# EAGLE design hs-256-expansion (EAGLE 8.3.2)
DESIGNER: Jonathan P. Newman; DESIGN_NAME: headstage-256 Expansion Boards; LICENSE: CERN OHL v1.2; REVISION: 1.0
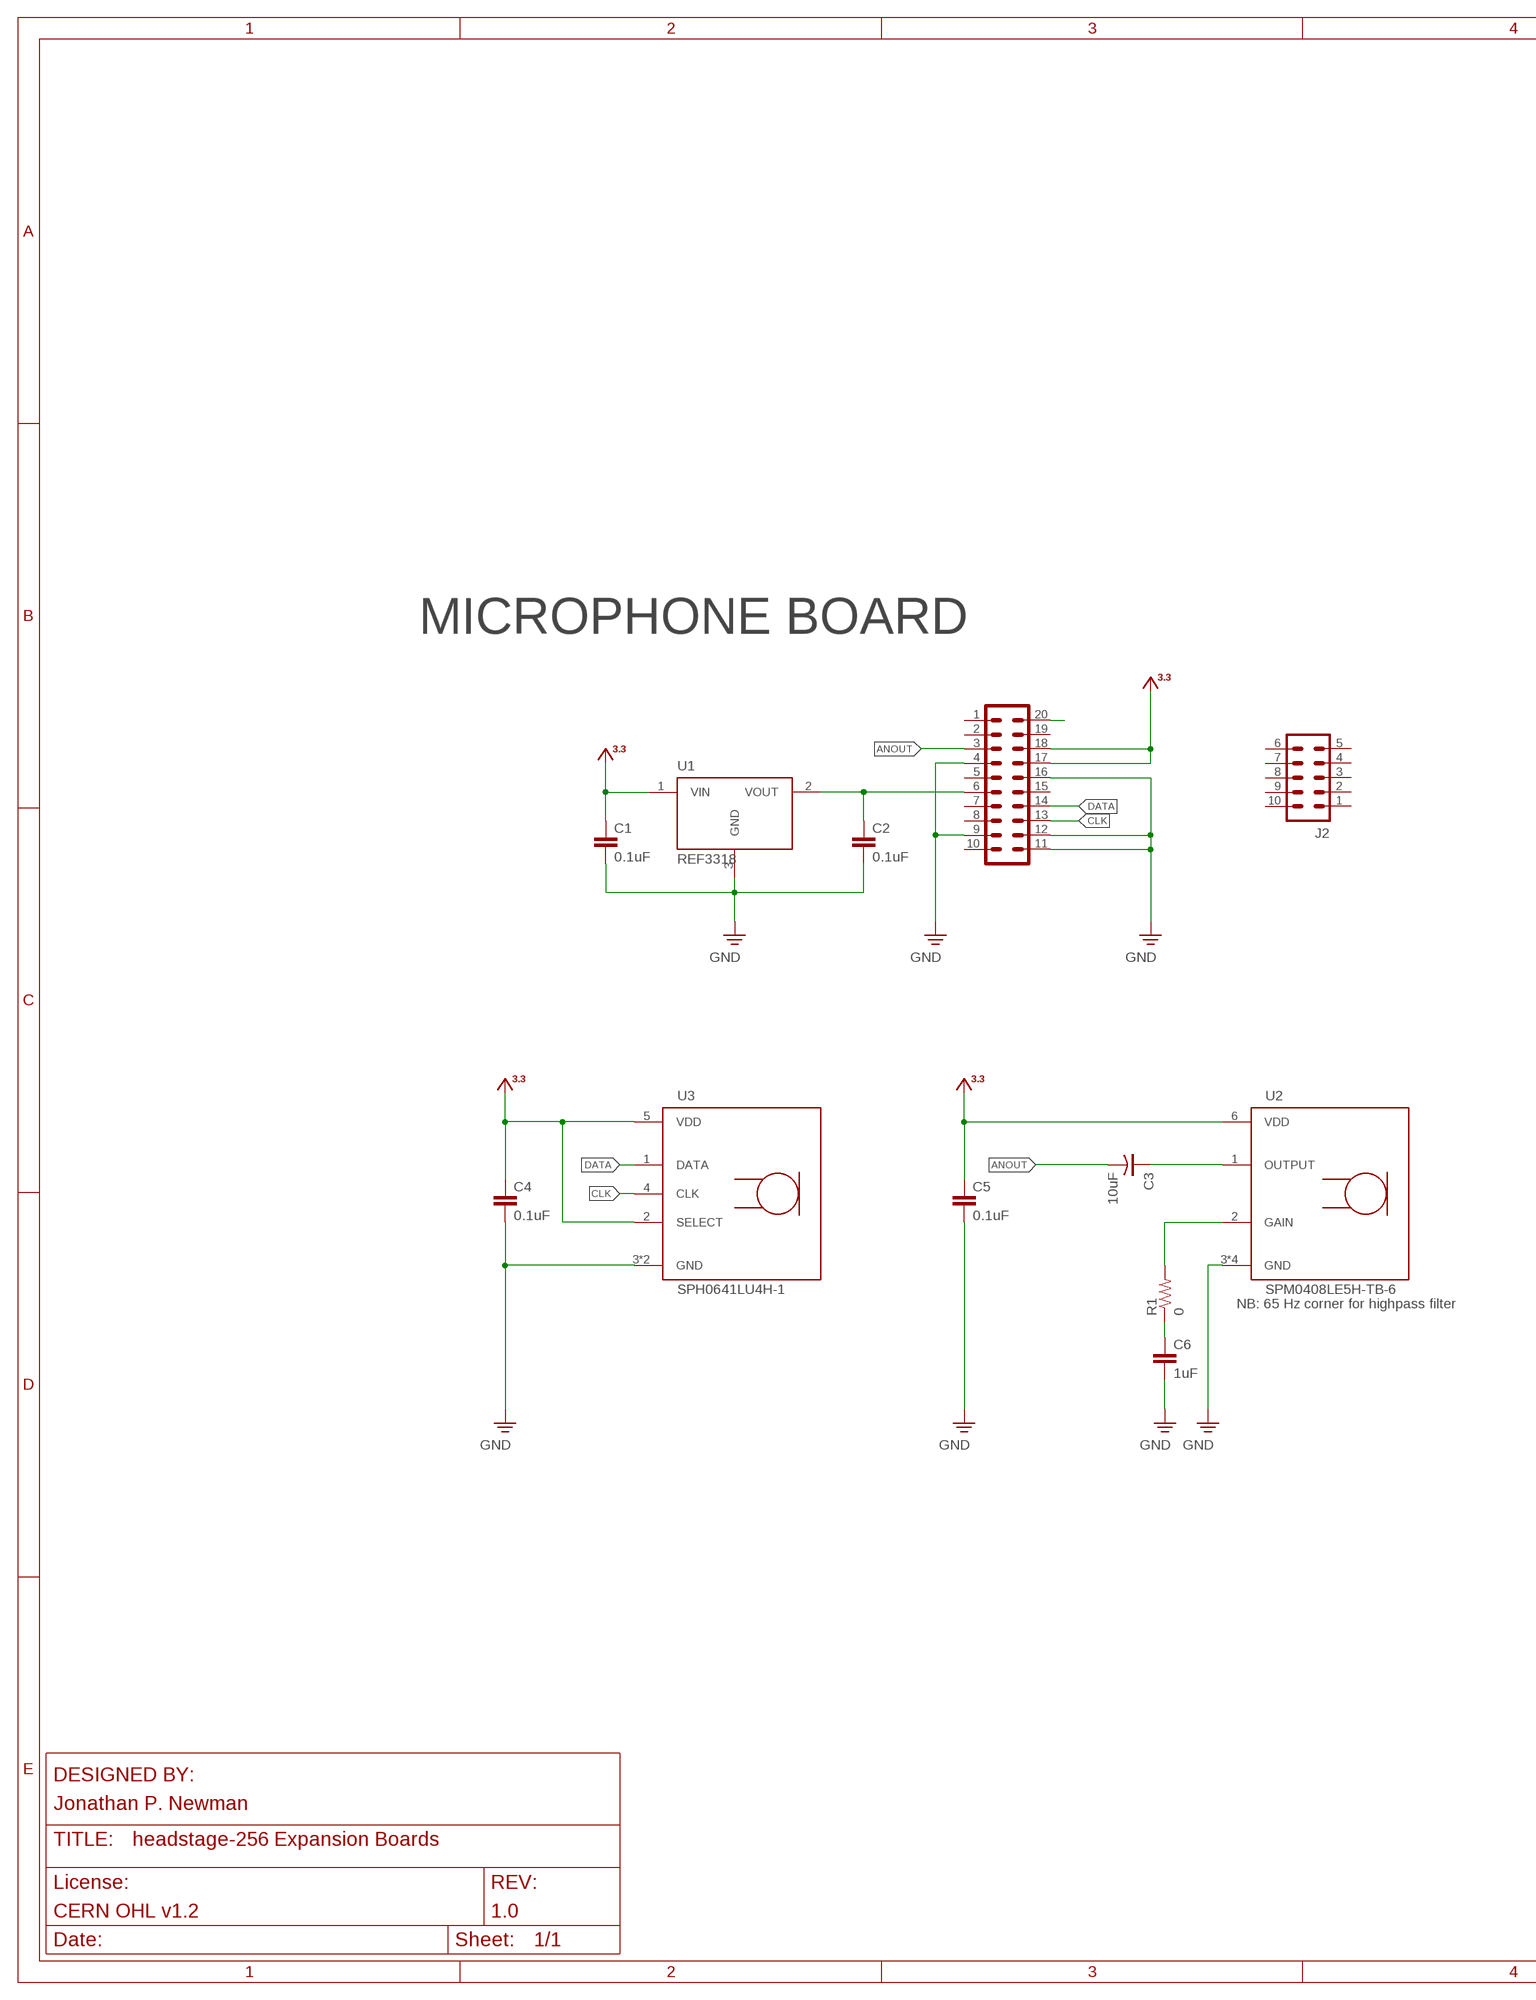
[diagram p0: schematic, sheet 1, part 1 of 2]
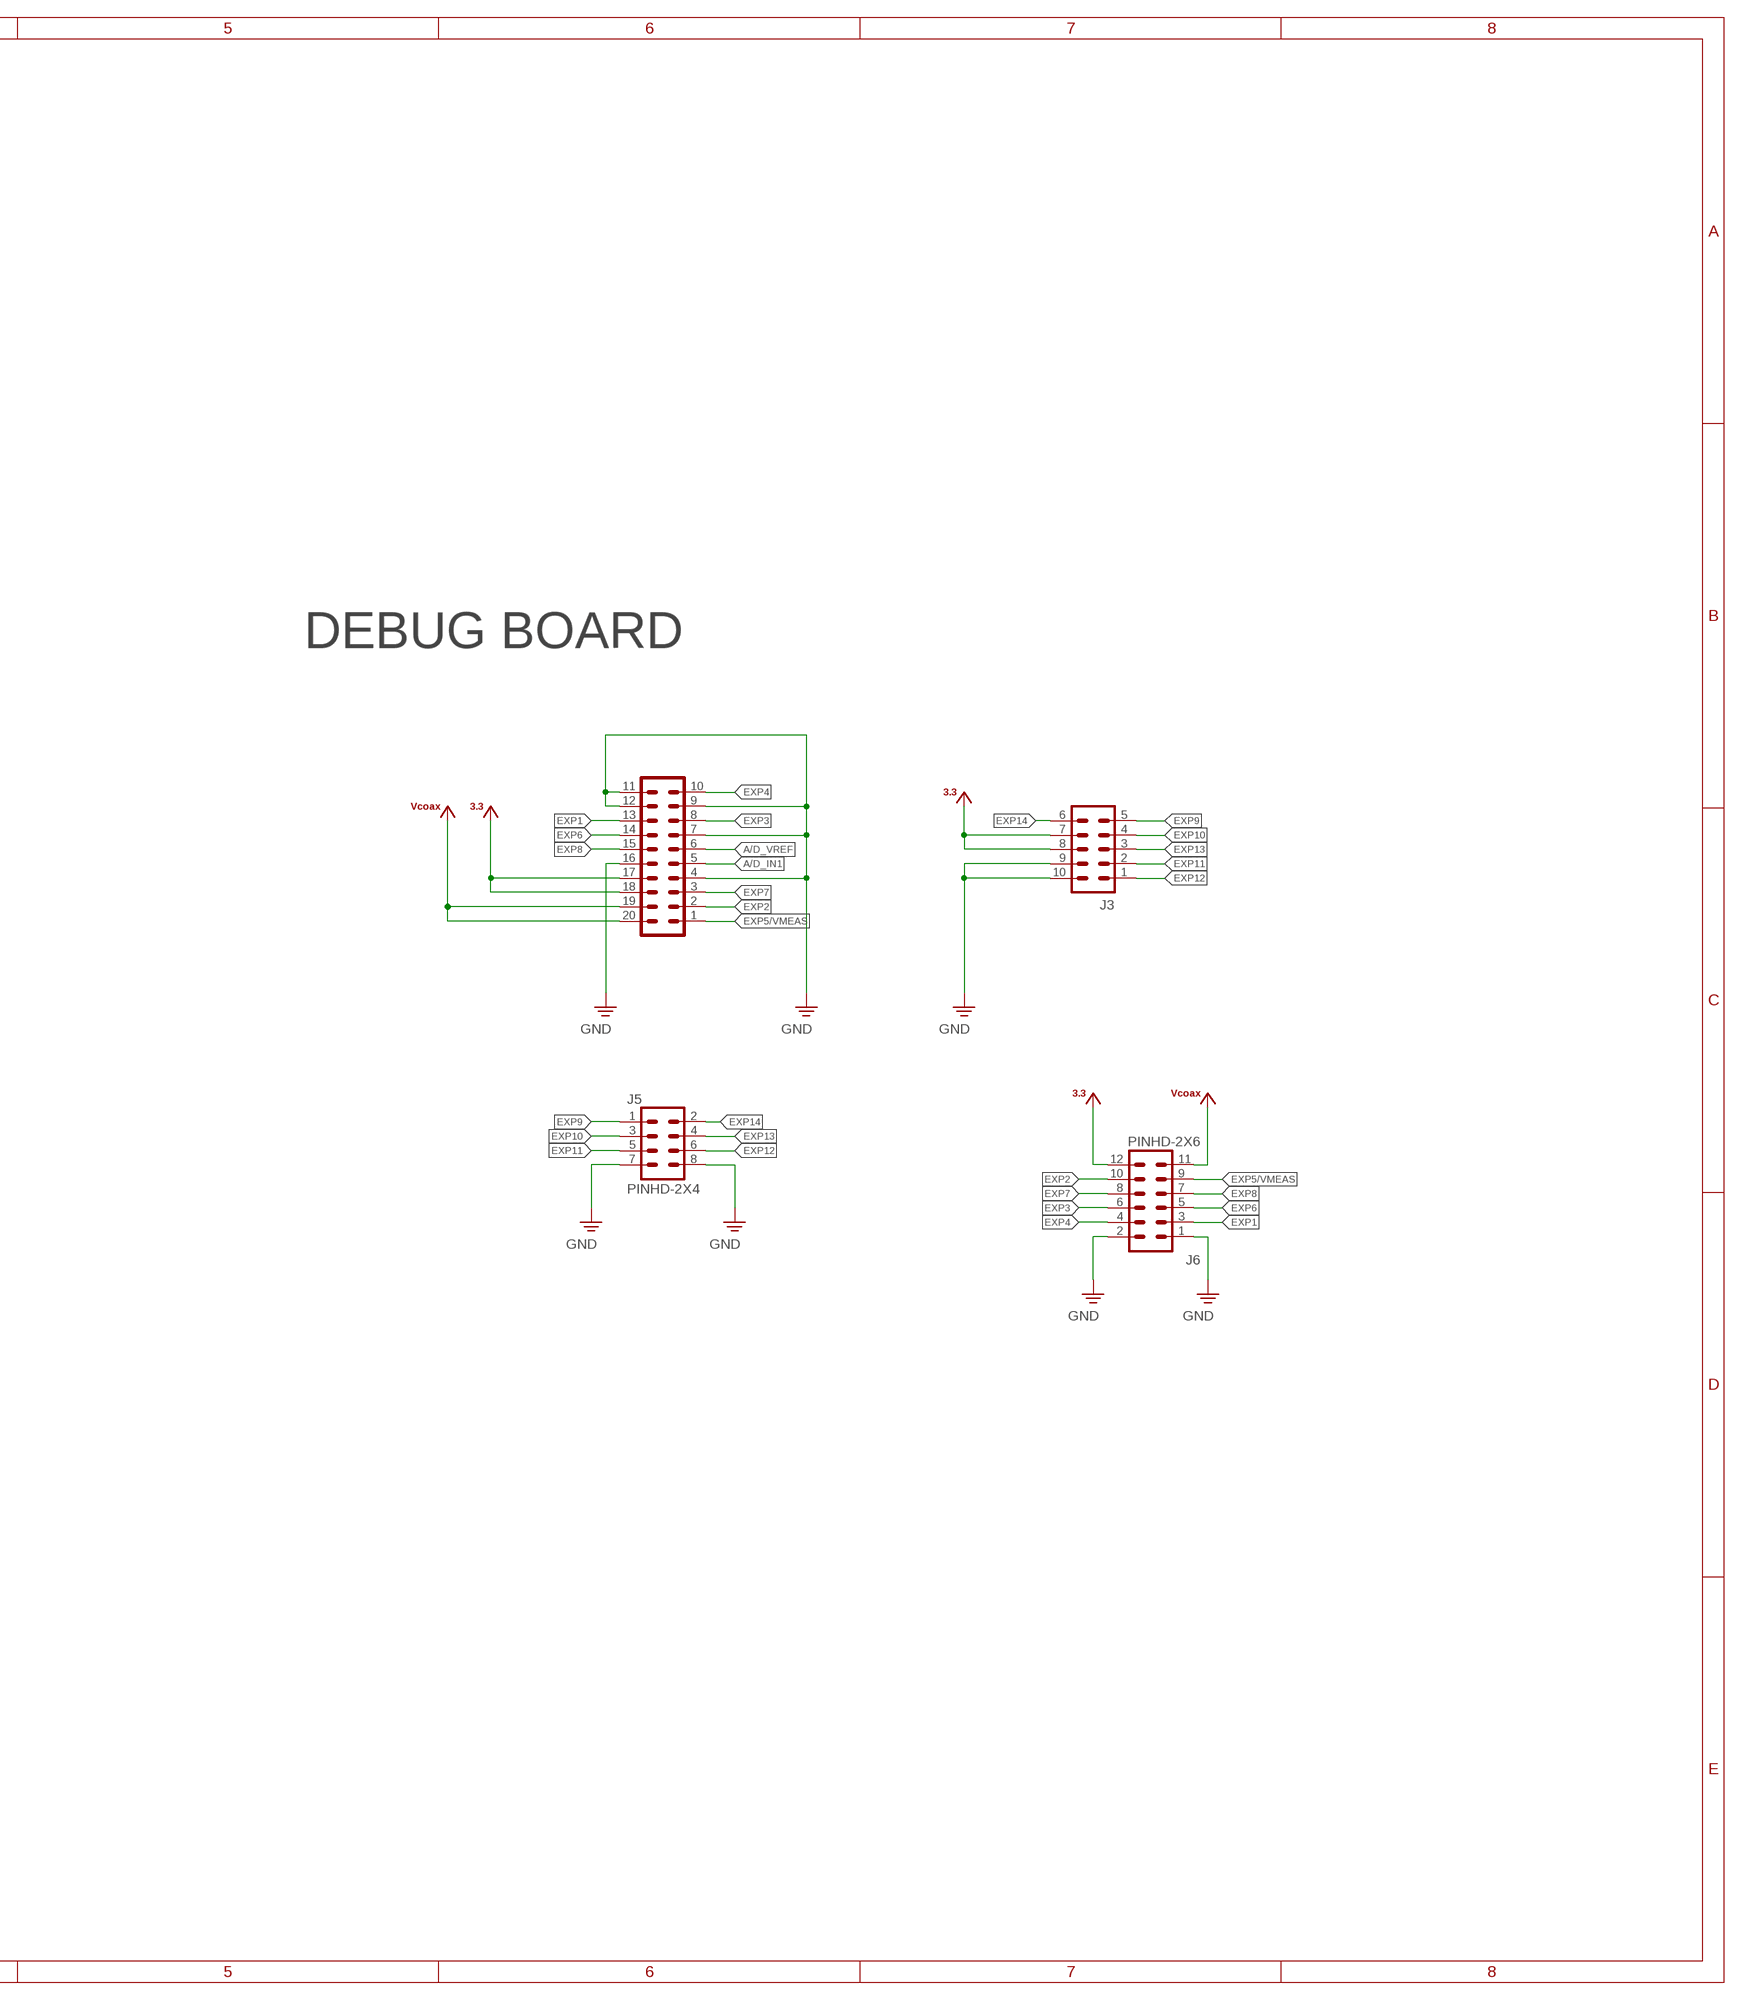
[diagram p1: schematic, sheet 1, part 2 of 2]

## Parts
C1  0.1uF  C_0402  [0402]
C2  0.1uF  C_0402  [0402]
C3  10uF  C-POL_0805  [0805-POL]
C4  0.1uF  C_0402  [0402]
C5  0.1uF  C_0402  [0402]
C6  1uF  C_0402  [0402]
J1  PINHD-2X10_DF40-20REC  [DF40-20REC]
J2  PINHD-2X5_DF40-REC  [DF40-10REC]
J3  PINHD-2X5_DF40-REC  [DF40-10REC]
J4  PINHD-2X10_DF40-20REC  [DF40-20REC]
J5  PINHD-2X4  [2X04-BIG]
J6  PINHD-2X6  [2X06-BIG]
R1  0  R_0402  [0402]
U1  REF3318  VREF_SOT  [SOT23]
U2  SPM0408LE5H-TB-6  MICROPHONE-AN_SPM  [KNOWLES-SPM]
U3  SPH0641LU4H-1  MICROPHONE-PCM_SPH  [KNOWLES-SPH]

## Nets
+3V3: C1.1 C4.1 C5.1 J1.17 J1.18 J3.7 J3.8 J4.17 J4.18 J6.12 U1.1(VIN) U2.6(VDD) U3.2(SELECT) U3.5(VDD)
A/D_IN1: J4.5
A/D_VREF: J4.6
ANOUT: C3.C(-) J1.3
CLK: J1.13 U3.4(CLK)
DATA: J1.14 U3.1(DATA)
EXP1: J4.13 J6.3
EXP2: J4.2 J6.10
EXP3: J4.8 J6.6
EXP4: J4.10 J6.4
EXP5/VMEAS: J4.1 J6.9
EXP6: J4.14 J6.5
EXP7: J4.3 J6.8
EXP8: J4.15 J6.7
EXP9: J3.5 J5.1
EXP10: J3.4 J5.3
EXP11: J3.2 J5.5
EXP12: J3.1 J5.6
EXP13: J3.3 J5.4
EXP14: J3.6 J5.2
GND: C1.2 C2.2 C4.2 C5.2 C6.2 J1.4 J1.9 J1.11 J1.12 J1.16 J3.9 J3.10 J4.4 J4.7 J4.9 J4.11 J4.12 J4.16 J5.7 J5.8 J6.1 J6.2 U1.3(GND) U2.3(GND) U2.4(GND) U2.5(GND) U2.7(GND) U3.3(GND) U3.6(GND)
N$1: C6.1 R1.1
N$2: J1.20
N$3: R1.2 U2.2(GAIN)
N$5: C3.A(+) U2.1(OUTPUT)
VCOAX: J4.19 J4.20 J6.11 ; supply symbol labelled +VCOAX
VREF: C2.1 J1.6 U1.2(VOUT)
Unconnected: J1.1 J1.2 J1.5 J1.7 J1.8 J1.10 J1.15 J1.19 J2.1 J2.2 J2.3 J2.4 J2.5 J2.6 J2.7 J2.8 J2.9 J2.10

## Notes on the sheet
- MICROPHONE BOARD | DEBUG BOARD
- NB: 65 Hz corner for highpass filter

## Library data of the parts
C1 C2 C4-C6 = jonnew:C: Capacitor
C3 = jonnew:C-POL: Polarized Capacitor
J1 J4 = jonnew:PINHD-2X10
J2 J3 = jonnew:PINHD-2X5
J5 = jonnew:PINHD-2X4
J6 = jonnew:PINHD-2X6
R1 = jonnew:R: Resistor
U1 = jonnew:VREF
U2 = jonnew:MICROPHONE-AN
U3 = jonnew:MICROPHONE-PCM

## Board
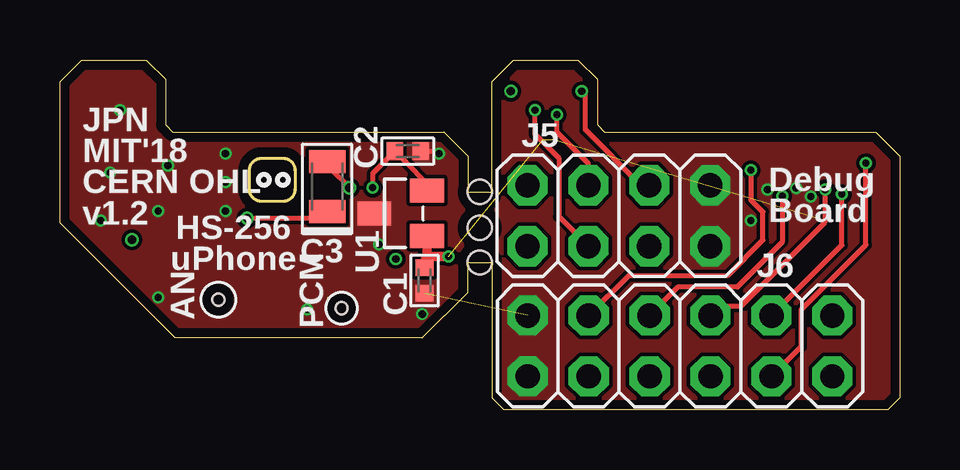
[diagram p2: board, top side]
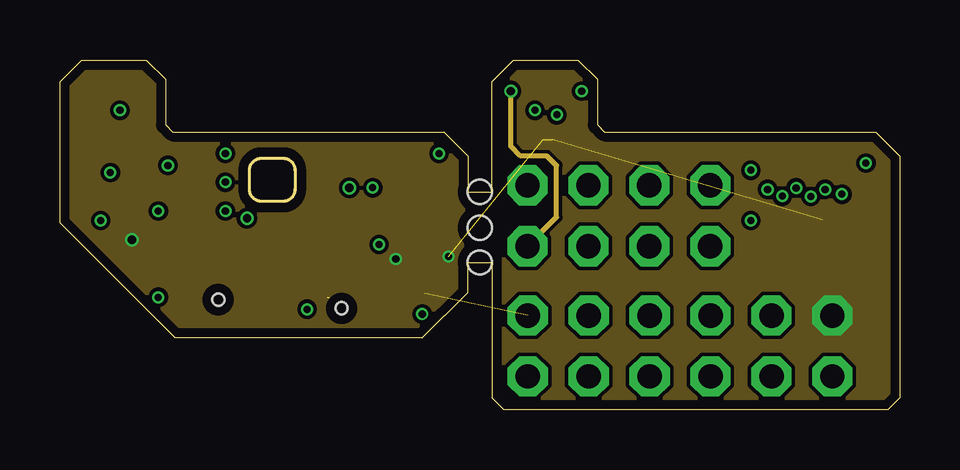
[diagram p3: board, inner layer Route2]
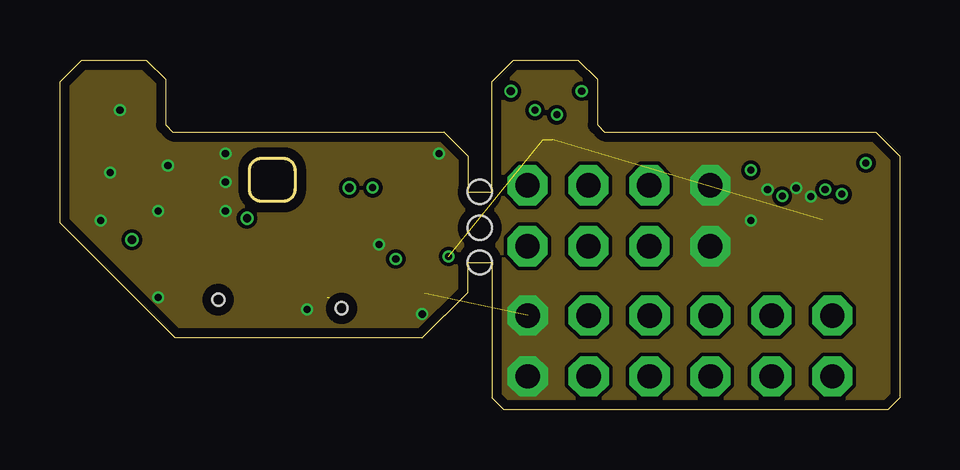
[diagram p4: board, inner layer Route15]
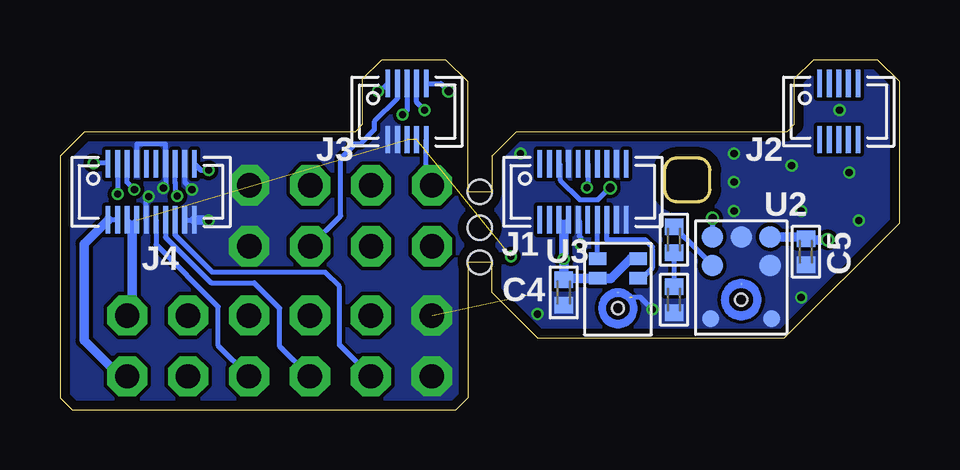
[diagram p5: board, bottom side, seen from below]

Size 35 x 14.6 mm. Coordinates in mm from the lower left corner, seen from the top.
Outline: 0,7.8 0,13.7 0.9,14.6 3.6,14.6 4.4,13.8 4.4,11.9 4.7,11.6 16,11.6 17,10.6 17,9.1 18,9.1 18,13.7 18.9,14.6 21.6,14.6 22.4,13.8 22.4,11.9 22.7,11.6 34,11.6 35,10.6 35,0.5 34.5,0 18.5,0 18,0.5 18,6.15 17,6.15 17,4.9 15.1,3 4.8,3 0,7.8
Copper layers (1*2*15*16): Top 0.035mm / dielectric 0.2mm / Route2 0.0175mm / dielectric 0.3mm / Route15 0.0175mm / dielectric 0.2mm / Bottom 0.035mm
Design rules "seeed-studio-4-layer": minimum track width 6mil, minimum drill 0.3mm, track to track 6mil, track to pad 6mil, pad to pad 6mil, via to via 6mil, smd to smd 0mil, copper to edge 0.4mm, drill to drill 10mil, minimum pad ring 6mil, minimum via ring 4mil, stop-mask expansion 4mil, vias tented up to drill 100mil, thermal gap 10mil
Holes 1 mm at 17.5,6.15 17.5,9.1 17.5,7.6

### Footprints (pad centres in the part's own frame; a part is rotated, then mirrored left to right if it is on the bottom)
0402 = smd 0.686 x 0.762: 1 -0.533,0; 2 0.533,0
0805-POL = smd 0.965 x 1.524: A -1.041,0; C 1.041,0
DF40-20REC = smd 0.2 x 1.14: 1 -1.8,1.17; 2 -1.4,1.17; 3 -1,1.17; 4 -0.6,1.17; 5 -0.2,1.17; 6 0.2,1.17; 7 0.6,1.17; 8 1,1.17; 9 1.4,1.17; 10 1.8,1.17; 11 1.8,-1.17; 12 1.4,-1.17; 13 1,-1.17; 14 0.6,-1.17; 15 0.2,-1.17; 16 -0.2,-1.17; 17 -0.6,-1.17; 18 -1,-1.17; 19 -1.4,-1.17; 20 -1.8,-1.17
DF40-10REC = smd 0.2 x 1.14: 1 -0.8,1.17; 2 -0.4,1.17; 3 0,1.17; 4 0.4,1.17; 5 0.8,1.17; 6 0.8,-1.17; 7 0.4,-1.17; 8 0,-1.17; 9 -0.4,-1.17; 10 -0.8,-1.17
2X04-BIG = drill 1.016 pad 1.676 octagon: 1 -3.81,-1.27; 2 -3.81,1.27; 3 -1.27,-1.27; 4 -1.27,1.27; 5 1.27,-1.27; 6 1.27,1.27; 7 3.81,-1.27; 8 3.81,1.27
2X06-BIG = drill 1.016 pad 1.676 octagon: 1 0,0; 2 0,2.54; 3 2.54,0; 4 2.54,2.54; 5 5.08,0; 6 5.08,2.54; 7 7.62,0; 8 7.62,2.54; 9 10.16,0; 10 10.16,2.54; 11 12.7,0; 12 12.7,2.54
SOT23 = smd 1 x 1.4: 1 -0.95,-1.1; 2 0.95,-1.1; 3 0,1.1
KNOWLES-SPM = smd 0.9 x 0.9: 1 -1.204,2.616; 2 -1.204,1.422; 5 1.204,1.422; 6 1.204,2.616; 7 0,2.616 | smd 0.7 x 0.7: 3 -1.265,-0.79; 4 1.265,-0.79 | smd 0.1 x 0.1: 8 0,0.66 | hole 0.5: 0,0
KNOWLES-SPH = smd 0.725 x 0.522: 1 -0.838,2.074; 2 -0.838,1.252; 4 0.838,1.252; 5 0.838,2.074 | smd 0.1 x 0.1: 3 0,0.66; 6 0.5,0.46 | hole 0.5: 0,0

### Placement (x,y rotation side)
C1  15.2,5.4 270 top
C2  14.5,10.8 0 top
C3  11.14,9.32 90 top
C4  14,4.9 270 bottom
C5  3.9,6.6 270 bottom
C6  9.4,4.6 270 bottom
J1  13.2,9.1 0 bottom
J2  2.53,12.45 0 bottom
J3  20.53,12.45 0 bottom
J4  31.2,9.1 0 bottom
J5  23.3,8.1 0 top
J6  19.5,1.4 0 top
R1  9.4,7.1 90 bottom
U1  14.2,8.2 90 top
U2  6.6,4.6 0 bottom
U3  11.74,4.24 0 bottom

### Tracks (layer width: path | path; a pad name or v marks a point on that pad's centre or on a via)
+3V3  (via drill 0.3, 0.35)  (3 unrouted)
  Top 0.4: v16.2,6.4 15.27,6.4 C1.1 15.3,6.03 U1.1
  Bottom 0.2: J1.17 14,7.73 J1.18 | J6.12 32.2,4.44 | 32,7.73 J4.18 | 32,7.73 32,7.3 | 32,7.73 J4.17
  Bottom 0.4: U2.6 3.98,7.22 C5.1 3.87,7.1 v3,7.1 | 14,7.73 v14,6.3 C4.1 13.94,5.49 U3.2 12.02,5.49 11.2,6.31 U3.5 | J6.12 arc-90 32,4.14 32,7.3
  pour Route2 (no thermals): -3.8,17.1 39.2,17.1 39.2,-2.9 -3.8,-2.9
ANOUT  (via drill 0.35)
  Top 0.2: v12.06,9.27 11.26,10.08 arc-45 C3.C
  Bottom 0.2: J1.3 14.15,10.22 14.15,9.59 13.32,8.77 12.57,8.77 v12.06,9.27
CLK
  Bottom 0.2: J1.13 12.2,7.1 10.6,7.1 10.3,6.8 10.3,6.69 10.29,6.68 10.29,5.95 10.74,5.49
  Bottom 0.4: U3.4 10.74,5.49
DATA
  Bottom 0.2: U3.1 12.6,6.34 J1.14
EXP1
  Bottom 0.2: J4.13 30.2,7.3 28.64,5.74 23.94,5.74 23.35,5.15 23.35,2.71 J6.3
EXP2  (via drill 0.3)
  Top 0.2: J6.10 32.6,6.88 v32.6,9
  Bottom 0.2: J4.2 v32.6,9
EXP3  (via drill 0.3)
  Top 0.2: v30.11,8.92 30.11,7 28.24,5.13 25.77,5.13 J6.6
  Bottom 0.2: v30.11,8.92 30.19,9 30.19,9.47 30.2,9.48 J4.8
EXP4  (via drill 0.3)
  Top 0.2: v28.8,10 28.8,8.76 29.3,8.26 29.3,7.08 27.82,5.6 23.7,5.6 J6.4
  Bottom 0.2: J4.10 29.13,10 v28.8,10
EXP5/VMEAS  (via drill 0.3)
  Top 0.2: v33.6,10.3 33.6,6.88 30.9,4.19 30.9,2.64 J6.9
  Bottom 0.2: J4.1 33.03,10.3 v33.6,10.3
EXP6
  Bottom 0.2: J4.14 30.6,7.2 28.7,5.3 26.9,5.3 25.84,4.24 25.84,2.66 J6.5
EXP7  (via drill 0.3)
  Top 0.2: J6.8 27.53,4.35 28.4,4.35 31.9,7.85 v31.9,9.2
  Bottom 0.2: v31.9,9.2 32.2,9.5 J4.3
EXP8
  Bottom 0.2: J4.15 31,6.9 28.4,4.3 28.4,2.68 J6.7
EXP9  (via drill 0.35)
  Route2 0.2: J5.1 20.7,8.04 20.7,10.2 20.3,10.6 19.2,10.6 18.8,11 v18.8,13.3
  Bottom 0.2: J3.5 19.12,13.62 v18.8,13.3
EXP10  (via drill 0.3)
  Top 0.2: v19.8,12.5 19.8,11.5 20.8,10.5 20.8,8.06 J5.3
  Bottom 0.2: v19.8,12.5 20.13,12.83 J3.4
EXP11
  Bottom 0.2: J3.2 20.93,12.99 21.9,12.02 21.9,11.69 22.49,11.1 22.7,11.1 23.3,10.5 23.3,8.1 J5.5
EXP12  (via drill 0.3)
  Top 0.2: v21.75,13.3 21.9,13.15 21.9,11.69 24.22,9.37 J5.6
  Bottom 0.2: J3.1 21.65,13.3 v21.75,13.3
EXP13  (via drill 0.3)
  Top 0.2: v20.71,12.31 20.71,11.6 22.03,10.28 J5.4
  Bottom 0.2: v20.71,12.31 20.53,12.5 J3.3
EXP14
  Bottom 0.2: J5.2 19.73,9.61 J3.6
GND  (via drill 0.3)  (2 unrouted)
  Top 0.2: C2.2 15.7,10.8 v15.8,10.7
  Bottom 0.2: 11.7,4.94 U3.3 11.44,4.9 U3.6 | J1.16 13.35,7.88 13.35,7.25 13.3,7.2 v13.3,6.9 | J4.12 J4.11 | J4.16 31.4,8.7 v31.3,8.9 | J4.9 29.8,9.5 v29.5,9.2 | v30.69,9.26 30.6,9.35 J4.7 30.6,11.1 31.8,11.1 J4.4 | v10.3,4.2 10.8,4.7 11.14,4.7
  Bottom 0.4: v28.8,7.9 28.83,7.93 J4.11
  other vias: 6.9,9.5 4.1,4.7 15.1,4 6.9,10.7 6.9,8.3 2.1,9.9 2.5,12.5 4.5,10.2 1.7,7.9 4.1,8.3
  pour Route15 (no thermals): -4.8,18.1 40.2,18.1 40.7,-3.9 -4.8,-3.9
  pour Bottom (no thermals): -2.8,16.1 38.2,16.1 38.2,-1.9 -2.8,-1.9
  pour Top (no thermals): -1.8,15.1 37.2,15.1 37.2,-0.9 -1.8,-0.9
N$1
  Bottom 0.2: R1.1 C6.1
N$3
  Bottom 0.2: U2.2 7.8,6.05 8.91,7.16 8.93,7.16 R1.2
N$5  (via drill 0.35)
  Top 0.2: v7.8,8 10.74,8 C3.A
  Bottom 0.2: v7.8,8 U2.1
VCOAX
  Bottom 0.2: J4.19 J4.20
  Bottom 0.4: J4.20 34,6.93 34,2.9 32.5,1.4 J6.11
VREF  (via drill 0.3)
  Top 0.2: 13.04,9.34 v13.04,9.27 13.04,9.87 C2.1 14.44,10.33 14.44,10.31 15.3,9.45 U1.2
  Bottom 0.2: J1.6 13,9.31 v13.04,9.27

### Text on the board
tPlace: JPN / MIT'18 / CERN OHL / v1.2 | Debug / Board | HS-256 / uPhone | AN | PCM